# Altium project Diiferential_Amplifier.PrjPcb
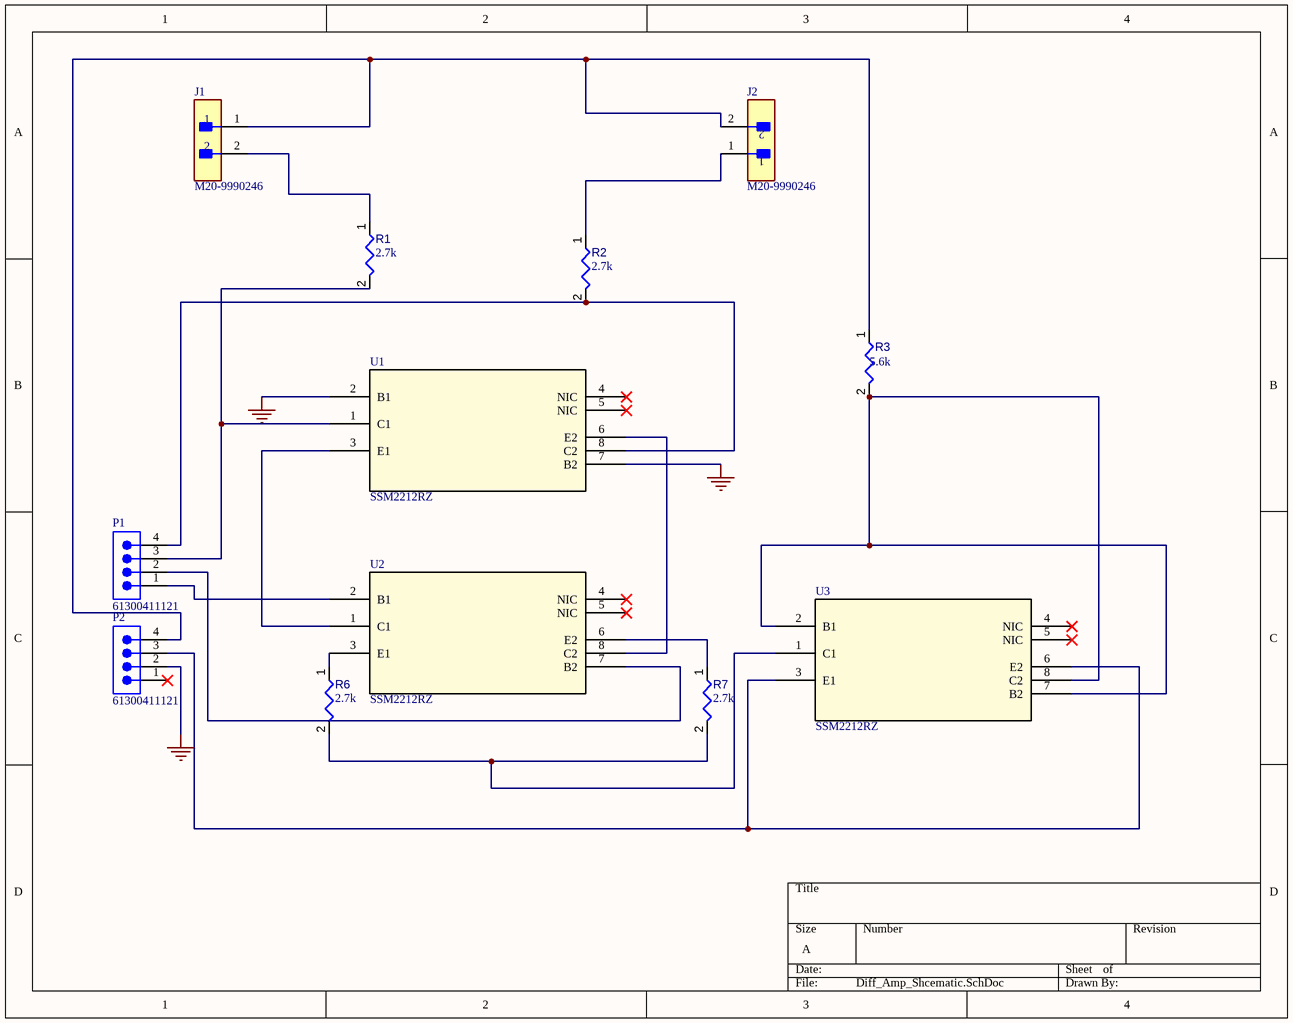
[diagram p0: Diff_Amp_Shcematic.SchDoc]
1 sheet, 12 parts. Net scope: global (net labels, ports and power ports of the same name join across sheets).
Board file: Diff_Amp_PCB.PcbDoc

## Sheet Diff_Amp_Shcematic.SchDoc
size A; SheetNumber: 1; SheetTotal: 1

### Parts
J1  M20-9990246  [FP-M20-9990246-MFG]
J2  M20-9990246  [FP-M20-9990246-MFG]
P1  61300411121  [61300411121]
P2  61300411121  [61300411121]
R1  value 2.7k  [FP-CRCW0805-e3-IPC_A]  (hidden comment: CRCW08052K70FKEA)
R2  value 2.7k  [FP-CRCW0805-e3-IPC_A]  (hidden comment: CRCW08052K70FKEA)
R3  value 5.6k  [FP-CRCW0805-e3-IPC_A]  (hidden comment: CRCW08052K70FKEA)
R6  value 2.7k  [FP-CRCW0805-e3-IPC_A]  (hidden comment: CRCW08052K70FKEA)
R7  value 2.7k  [FP-CRCW0805-e3-IPC_A]  (hidden comment: CRCW08052K70FKEA)
U1  SSM2212RZ  [R_8_ADI]
U2  SSM2212RZ  [R_8_ADI]
U3  SSM2212RZ  [R_8_ADI]

### Nets
GND: P2.2 U1.2(B1) U1.7(B2)
NetJ1_1: J1.1 J2.2 P2.4 R3.1
NetJ1_2: J1.2 R1.1
NetJ2_1: J2.1 R2.1
NetP1_1: P1.1 U2.2(B1)
NetP1_2: P1.2 U2.7(B2)
NetP1_3: P1.3 R1.2 U1.1(C1)
NetP1_4: P1.4 R2.2 U1.8(C2)
NetP2_3: P2.3 U3.3(E1) U3.6(E2)
NetR3_2: R3.2 U3.2(B1) U3.7(B2) U3.8(C2)
NetR6_1: R6.1 U2.3(E1)
NetR6_2: R6.2 R7.2 U3.1(C1)
NetR7_1: R7.1 U2.6(E2)
NetU1_3: U1.3(E1) U2.1(C1)
NetU1_6: U1.6(E2) U2.8(C2)

Not connected (* = marked no-connect by the designer): P2 1*; U1 4(NIC)* 5(NIC)*; U2 4(NIC)* 5(NIC)*; U3 4(NIC)* 5(NIC)*

### Library data of the parts
J1 J2 = CMP-002-00800-1: Board Connector, 2 Contact(s), 1 Row(s), Male, Straight, 0.1 inch Pitch, Solder Terminal, Locking, Black Insulator; Max Operating Temperature: 105°C; Min Operating Temperature: -40°C; Mounting Technology: Board; Connector Type: BOARD CONNECTOR; RoHS Compliant: Yes
P1 P2 = CMP-002-00806-1: Board Connector, 4 Contact(s), 1 Row(s), Male, Straight, 0.1 inch Pitch, Solder Terminal, Locking, Black Insulator, Plug; Connector Type: BOARD CONNECTOR; Min Operating Temperature: -40°C; Mounting Technology: Board; Max Operating Temperature: 125°C; RoHS Compliant: Yes
R1-R3 R6 R7 = CMP-009-00327-1: Fixed Resistor, Metal Glaze/thick Film, 0.125W, 2700ohm, 150V, 1% +/-Tol, 100ppm/Cel, Surface Mount, 0805; Power: 125mW; Mounting Technology: Surface Mount; Max Operating Temperature: 155°C; Tolerance: 1%; Min Operating Temperature: -55°C; Case/Package: 0805; Pins: 2; RoHS Compliant: Yes
U1-U3 = CMP-034-000000-1: No Description Available; Mfr_Name: Analog Devices Inc; Source: SSM2212RZ.SchLib; Design Item ID: SSM2212RZ; Type: Type; RefDes: RefDes